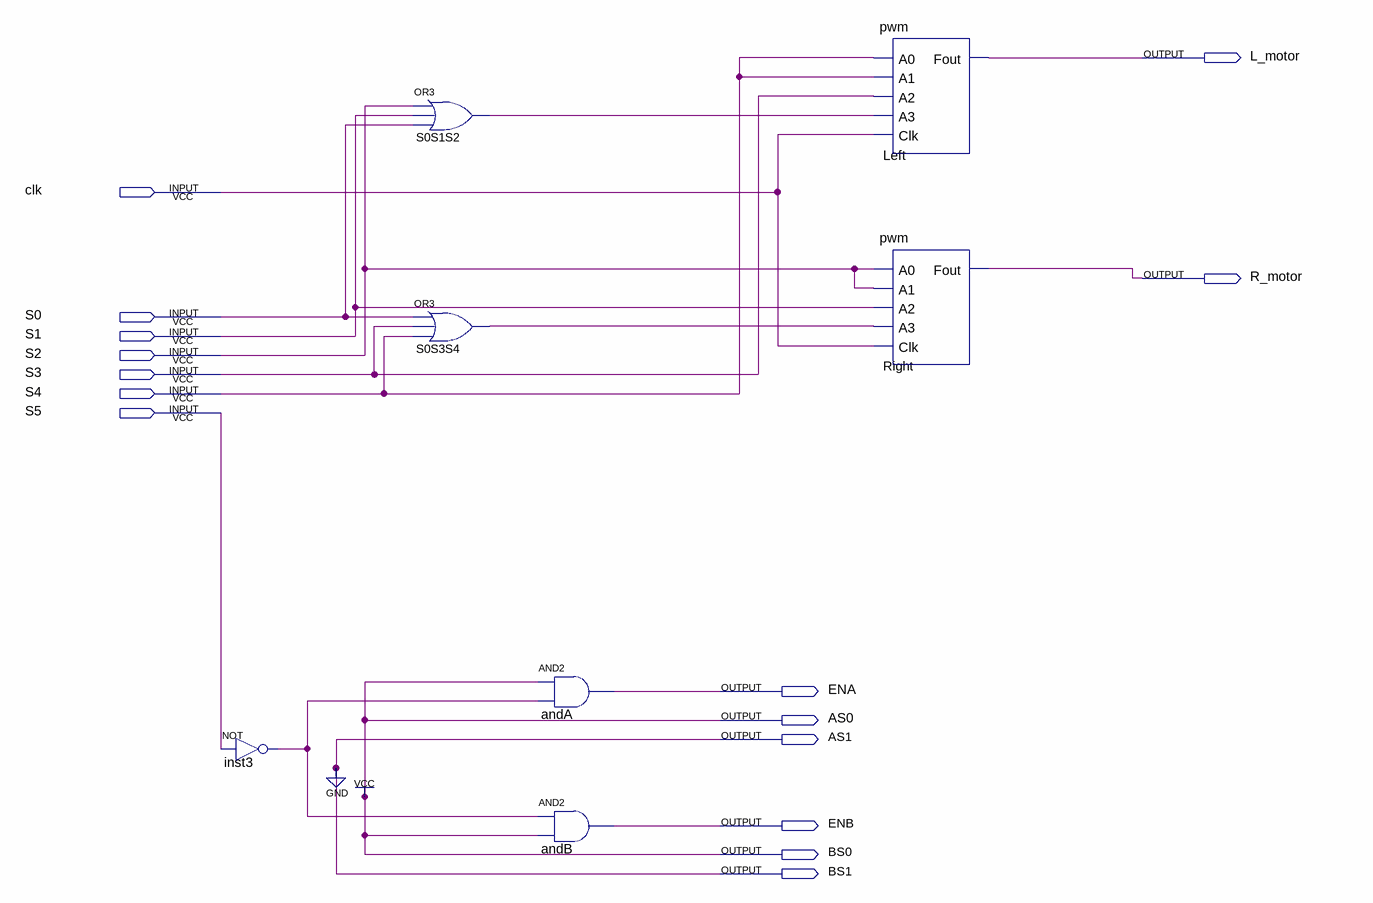
[diagram p0: schematic sheet]
// Quartus schematic testfull.bdf as structural Verilog: 7 symbols, 15 pins
module testfull (
  input  clk,
  input  S0,
  input  S1,
  input  S2,
  input  S3,
  input  S4,
  input  S5,
  output L_motor,
  output R_motor,
  output ENA,
  output AS0,
  output AS1,
  output ENB,
  output BS0,
  output BS1
);

  wire inst3_out, S0S1S2_out, S0S3S4_out;

  not inst3 (inst3_out, S5);
  or S0S1S2 (S0S1S2_out, S2, S1, S0);
  or S0S3S4 (S0S3S4_out, S0, S3, S4);
  and andA (ENA, 1'b1, inst3_out);
  and andB (ENB, inst3_out, 1'b1);
  pwm Left (.A0(S4), .A1(S4), .A2(S3), .A3(S0S1S2_out), .Clk(clk), .Fout(L_motor));
  pwm Right (.A0(S2), .A1(S2), .A2(S1), .A3(S0S3S4_out), .Clk(clk), .Fout(R_motor));

  assign AS0 = 1'b1;
  assign AS1 = 1'b0;
  assign BS0 = 1'b1;
  assign BS1 = 1'b0;
endmodule
